# Altium schematic sheet Filtre_PWM1kHz.SchDoc
size A4; SheetNumber: 3; SheetTotal: 4; SPICEModelCacheBKCTZZTD: <root> / <DocumentId>BKCTZZTD</DocumentId> / <CacheFrame Number="0"> / <Model Name="lf353" Kind="CKT"> / <Text>*////////////////////////////////////////////////////////// / *LF353 Wide Bandwidth Dual JFET-Input OP-AMP MACRO-MODEL / *////////////////////////////////////////////////////////// / * / * connections:    non-inverting input / *                 |   inverting input / *                 |   |   positive power supply / *                 |   |   |   negative power supply / *                 |   |   |   |   output / *                 |   |   |   |   | / *                 |   |   |   |   | / .SUBCKT LF353     1   2  99  50  28 / * / * PINOUT ORDER +IN -IN V+ V- OUT / * / * / *Features: / *Low supply current =                1.8mA / *Wide bandwidth =                     4MHz / *High slew rate =                   13V/uS / *Low offset voltage =                 10mV / * / *NOTE: Model is for single device only and simulated / *      supply current is 1/2 of total device current. / * / ****************INPUT STAGE************** / * / IOS 2 1 25P / *^Input offset current / R1 1 3 1E12 / R2 3 2 1E12 / I1 99 4 100U / J1 5 2 4 JX / J2 6 7 4 JX / R3 5 50 20K / R4 6 50 20K / *Fp2=12 MHz / C4 5 6 3.31573E-13 / * / ***********COMMON MODE EFFECT*********** / * / I2 99 50 1.7MA / *^Quiescent supply current / EOS 7 1 POLY(1) 16 49 5E-3 1 / *Input offset voltage.^ / R8 99 49 50K / R9 49 50 50K / * / *********OUTPUT VOLTAGE LIMITING******** / V2 99 8 2.13 / D1 9 8 DX / D2 10 9 DX / V3 10 50 2.13 / * / **************SECOND STAGE************** / * / EH 99 98 99 49 1 / F1 9 98 POLY(1) VA3 0 0 0 1.0985E7 / G1 98 9 5 6 1E-3 / R5 98 9 100MEG / VA3 9 11 0 / *Fp1=40.3 HZ / C3 98 11 39.493P / * / ***************POLE STAGE*************** / * / *Fp3=42 MHz / G3 98 15 9 49 1E-6 / R12 98 15 1MEG / C5 98 15 3.7894E-15 / * / *********COMMON-MODE ZERO STAGE********* / * / G4 98 16 3 49 1E-8 / L2 98 17 31.831M / R13 17 16 1K / * / **************OUTPUT STAGE************** / * / F6  99 50 VA7 1 / F5  99 23 VA8 1 / D5  21 23 DX / VA7 99 21 0 / D6  23 99 DX / E1  99 26 99 15 1 / VA8 26 27 0 / R16 27 28 35 / V5  28 25 0.1V / D4  25 15 DX / V4  24 28 0.1V / D3  15 24 DX / * / ***************MODELS USED************** / * / .MODEL DX D(IS=1E-15) / .MODEL JX PJF(BETA=1.25E-5 VTO=-2.00 IS=50E-12) / * / .ENDS</Text> / </Model> / </CacheFrame> / </root>
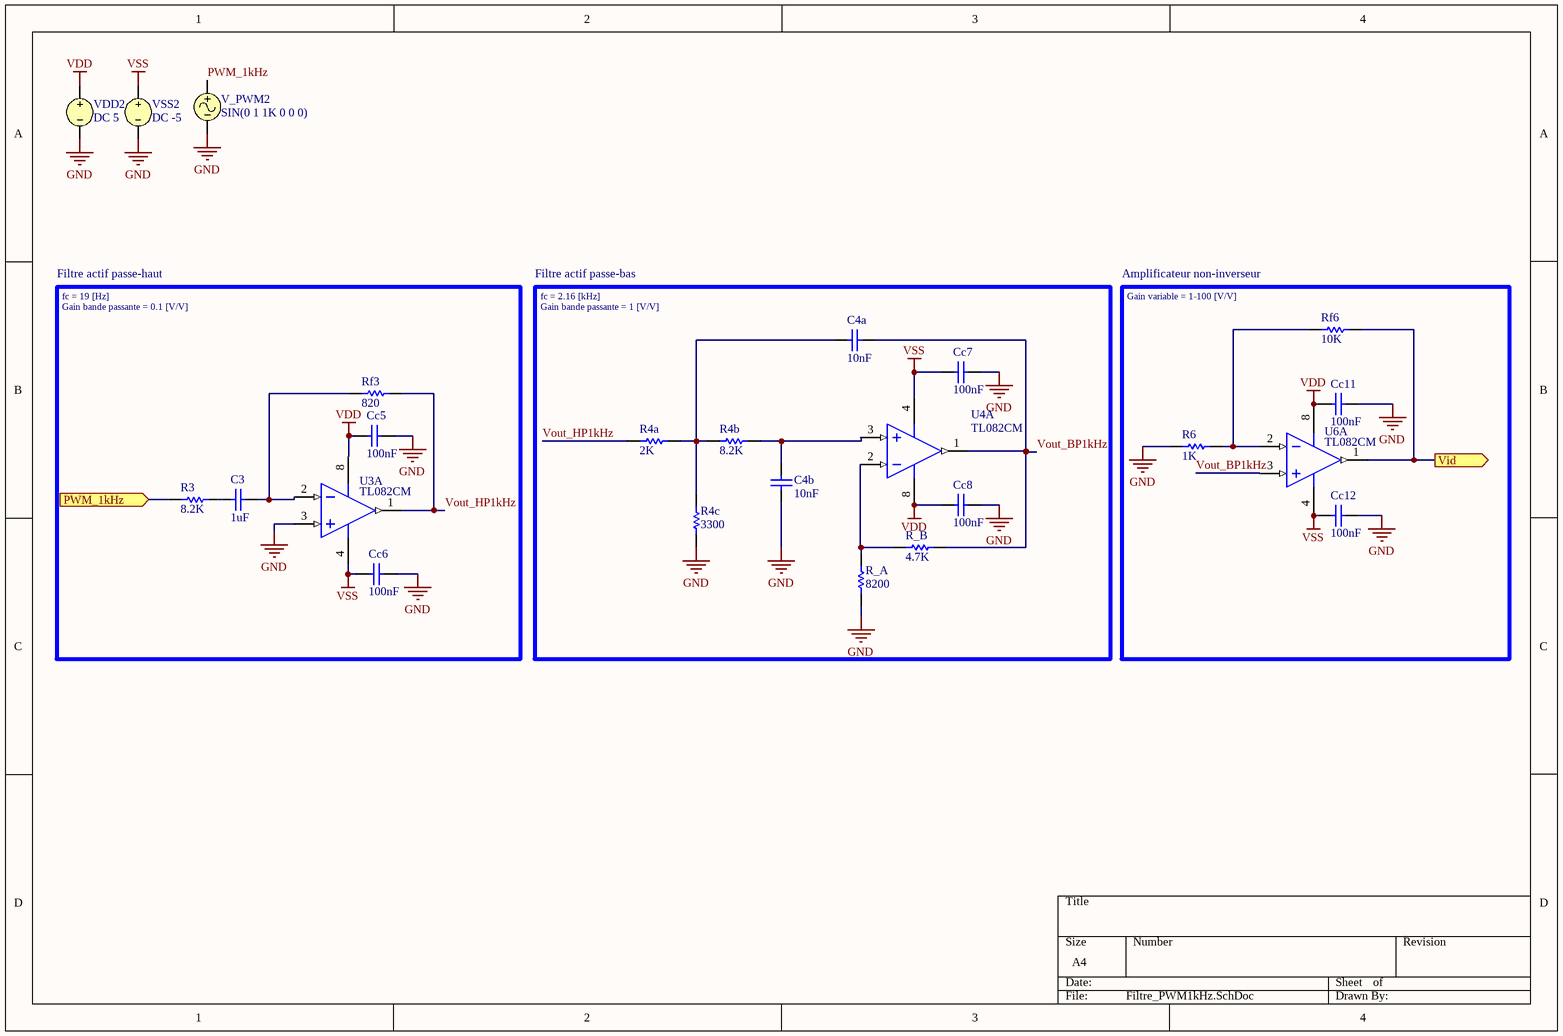
[diagram p0: Filtre_PWM1kHz.SchDoc]

## Parts
C3  value 1uF  [RAD-0.3]  (hidden comment: Cap)
C4a  value 10nF  [RAD-0.3]  (hidden comment: Cap)
C4b  value 10nF  [RAD-0.3]  (hidden comment: Cap)
Cc5  value 100nF  [RAD-0.3]  (hidden comment: Cap)
Cc6  value 100nF  [RAD-0.3]  (hidden comment: Cap)
Cc7  value 100nF  [RAD-0.3]  (hidden comment: Cap)
Cc8  value 100nF  [RAD-0.3]  (hidden comment: Cap)
Cc11  value 100nF  (hidden comment: Capacitor)
Cc12  value 100nF  (hidden comment: Capacitor)
R3  value 8.2K  [AXIAL-0.3]  (hidden comment: Res1)
R4a  value 2K  [AXIAL-0.3]  (hidden comment: Res1)
R4b  value 8.2K  [AXIAL-0.3]  (hidden comment: Res1)
R4c  value 3300  [AXIAL-0.3]  (hidden comment: Res1)
R6  value 1K  (hidden comment: Resistor)
R_A  value 8200  [AXIAL-0.3]  (hidden comment: Res1)
R_B  value 4.7K  [AXIAL-0.3]  (hidden comment: Res1)
Rf3  value 820  [AXIAL-0.3]  (hidden comment: Res1)
Rf6  value 10K  [AXIAL-0.3]  (hidden comment: Res1)
U3  TL082CM  [M08A_N]  (part A of 2)
U4  TL082CM  [M08A_N]  (part A of 2)
U6  TL082CM  [M08A_N]  (part A of 2)
V_PWM2  SIN(0 1 1K 0 0 0)
VDD2  DC 5
VSS2  DC -5

## Blocks framed on the sheet
Filtre actif passe-haut: C3 Cc5 Cc6 R3 Rf3 U3
Filtre actif passe-bas: C4a C4b Cc7 Cc8 R4a R4b R4c R_A R_B U4
Amplificateur non-inverseur: Cc11 Cc12 R6 Rf6 U6

## Ports
PWM_1kHz (in), Vid (out)

## Nets
GND: C4b.1 Cc5.2 Cc6.2 Cc7.2 Cc8.2 Cc11.2 Cc12.2 R4c.1 R6.1 R_A.1 U3.3(INA+) V_PWM2.2 VDD2.2 VSS2.2
VDD: Cc5.1 Cc8.1 Cc11.1 U3.8(V+) U4.8(V+) U6.8(V+) VDD2.1
VSS: Cc6.1 Cc7.1 Cc12.1 U3.4(V-) U4.4(V-) U6.4(V-) VSS2.1
PWM_1kHz: R3.1 ; port PWM_1kHz
PWM_1kHz: V_PWM2.1  [a separate net that carries the same name]
Vid: Rf6.2 U6.1(OUTA) ; port Vid
Vout_BP1kHz: C4a.1 R_B.2 U4.1(OUTA) U6.3(INA+)
Vout_HP1kHz: R4a.1 Rf3.2 U3.1(OUTA)
NetC3_1: C3.1 R3.2
NetC3_2: C3.2 Rf3.1 U3.2(INA-)
NetC4a_2: C4a.2 R4a.2 R4b.1 R4c.2
NetC4b_2: C4b.2 R4b.2 U4.3(INA+)
NetR6_2: R6.2 Rf6.1 U6.2(INA-)
NetR_A_2: R_A.2 R_B.1 U4.2(INA-)

## Notes on the sheet
- fc = 19 [Hz]
- Gain bande passante = 0.1 [V/V]
- fc = 2.16 [kHz]
- Gain bande passante = 1 [V/V]
- Gain variable = 1-100 [V/V]

## Library data of the parts
C3 C4a C4b Cc5-Cc8 = Cap: Capacitor; Published: 8-Jun-2000; LatestRevisionDate: 17-Jul-2002; LatestRevisionNote: Re-released for DXP Platform.; PackageReference: RAD-0.3; Publisher: Altium Limited; PackageDescription: Radial Cap, Thru-Hole; 2 Leads; 0.3 in Pin Spacing
Cc11 Cc12 = Capacitor: SimulationGenericComponent: True
R3 R4a R4b R4c R_A R_B Rf3 Rf6 = Res1: Resistor; Published: 8-Jun-2000; LatestRevisionDate: 17-Jul-2002; LatestRevisionNote: Re-released for DXP Platform.; PackageReference: AXIAL-0.3; Publisher: Altium Limited; PackageDescription: Axial Device, Thru-Hole; 2 Leads; 0.3 in Pin Spacing
R6 = Resistor: TC1: 0; SimulationGenericComponent: True; TC2: 0
U3 U4 U6 = TL082CM: Wide Bandwidth Dual JFET Input Operational Amplifier, 8-pin Narrow SOIC; Manufacturer: National Semiconductor; PackageTopMarking: NSZXTT*TL*082CM; PowerWise: N; CompType: Amplifiers; Published: 4-Dec-2008; LatestRevisionDate: 13-Jan-2009; LatestRevisionNote: Sim Model Added.; DatasheetVersion: Aug-2000; PackageVersion: revM, May-2009; PackageReference: M08A; Publisher: Altium Limited; PackageDescription: SOIC Narrow, 4.9 x 3.9 x 1.45mm, 8 Lead, 1.27mm Pitch; Supplier 1: Digi-Key; Supplier Part Number 1: TL082CM-ND; PartNumber: TL082CM; RoHS: N; PinCount: 8; Code_JEDEC: MS-012-AA; Code_IPC: SOIC127P600-8; ComponentLink1Description: TL082 Datasheet; ComponentLink1URL: http://www.national.com/ds/TL/TL082.pdf; ComponentLink2Description: TL082 Web Page; ComponentLink2URL: http://www.national.com/pf/TL/TL082.html; ComponentLink3Description: M08A Package Page; ComponentLink3URL: http://www.national.com/packaging/folders/m08a.html
V_PWM2 = VSIN: Sinusoidal Voltage Source; Note: PCB Footprint - Not required; Offset: 0; Amplitude: 1; Published: 8-Jun-2000; LatestRevisionDate: 15-Nov-2004; LatestRevisionNote: Corrected Netlist.; PackageReference: Not Applicable; Publisher: Altium Limited; Frequency: 1K; Delay: 0; Damping Factor: 0; Phase: 0; DC Magnitude: 0; AC Magnitude: 1; AC Phase: 0
VDD2 = VSRC: Voltage Source; Note: PCB Footprint - Not required; AC Magnitude: 1; AC Phase: 0; Value: 5; Published: 8-Jun-2000; LatestRevisionDate: 17-Jul-2002; LatestRevisionNote: Re-released for DXP Platform.; PackageReference: Not Applicable; Publisher: Altium Limited
VSS2 = VSRC: Voltage Source; Note: PCB Footprint - Not required; AC Magnitude: 1; AC Phase: 0; Published: 8-Jun-2000; LatestRevisionDate: 17-Jul-2002; LatestRevisionNote: Re-released for DXP Platform.; PackageReference: Not Applicable; Publisher: Altium Limited; Value: -5